# Altium schematic sheet WINGS_Components.SchDoc
size Tabloid; Revision: 1.000; SheetNumber: 2; SheetTotal: 2; Sheet_Name: Wings Components; Size: 11x17
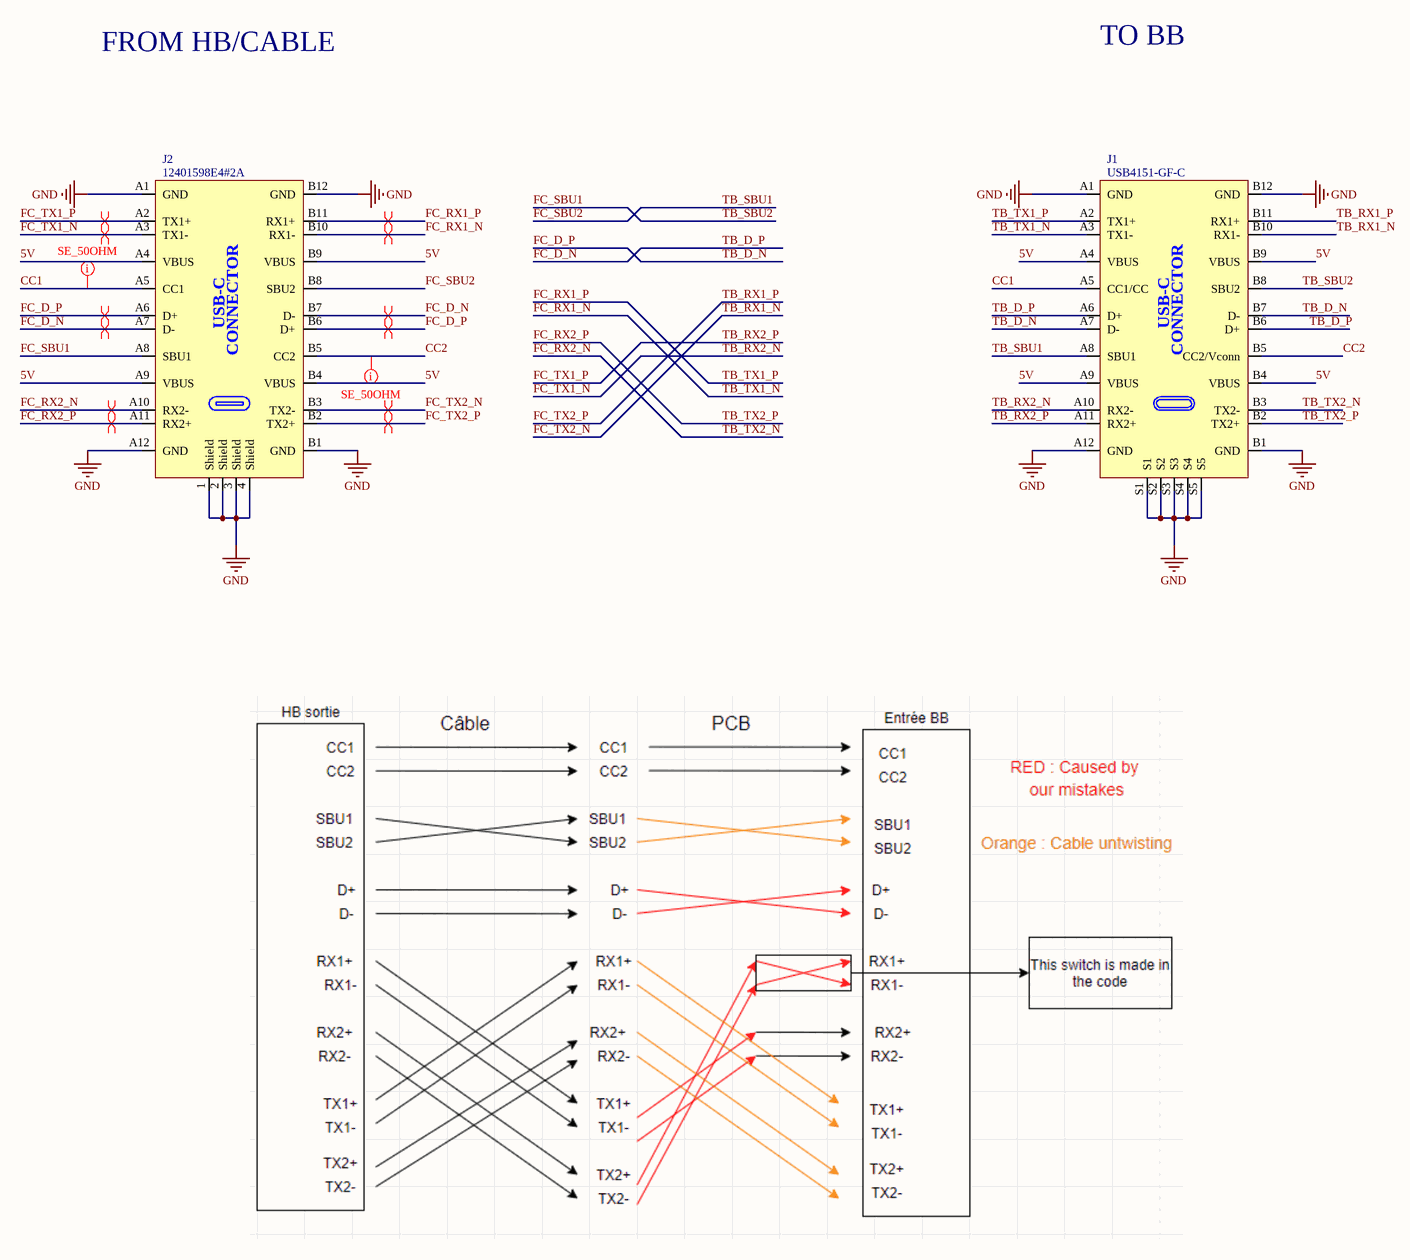
[diagram p0: WINGS_Components.SchDoc]

## Parts
J1  USB4151-GF-C  [CON_USB-C_USB4151-GF-C]
J2  12401598E4#2A  [CON_USB_3.2_TypeC_12401598E4#2A]

## Nets
GND: J1.A1(GND) J1.A12(GND) J1.B1(GND) J1.B12(GND) J1.S1 J1.S2 J1.S3 J1.S4 J1.S5 J2.1(Shield) J2.2(Shield) J2.3(Shield) J2.4(Shield) J2.A1(GND) J2.A12(GND) J2.B1(GND) J2.B12(GND)
5V: J1.A4(VBUS) J1.A9(VBUS) J1.B4(VBUS) J1.B9(VBUS) J2.A4(VBUS) J2.A9(VBUS) J2.B4(VBUS) J2.B9(VBUS)
CC1: J1.A5(CC1/CC) J2.A5(CC1)
CC2: J1.B5(CC2/Vconn) J2.B5(CC2)
FC_D_N: J1.A6(D+) J1.B6(D+) J2.A7(D-) J2.B7(D-)  [also labelled TB_D_P]
FC_D_P: J1.A7(D-) J1.B7(D-) J2.A6(D+) J2.B6(D+)  [also labelled TB_D_N]
FC_RX1_N: J1.A3(TX1-) J2.B10(RX1-)  [also labelled TB_TX1_N]
FC_RX1_P: J1.A2(TX1+) J2.B11(RX1+)  [also labelled TB_TX1_P]
FC_RX2_N: J1.B3(TX2-) J2.A10(RX2-)  [also labelled TB_TX2_N]
FC_RX2_P: J1.B2(TX2+) J2.A11(RX2+)  [also labelled TB_TX2_P]
FC_SBU1: J1.B8(SBU2) J2.A8(SBU1)  [also labelled TB_SBU2]
FC_SBU2: J1.A8(SBU1) J2.B8(SBU2)  [also labelled TB_SBU1]
FC_TX1_N: J1.A10(RX2-) J2.A3(TX1-)  [also labelled TB_RX2_N]
FC_TX1_P: J1.A11(RX2+) J2.A2(TX1+)  [also labelled TB_RX2_P]
FC_TX2_N: J1.B10(RX1-) J2.B3(TX2-)  [also labelled TB_RX1_N]
FC_TX2_P: J1.B11(RX1+) J2.B2(TX2+)  [also labelled TB_RX1_P]

## Layout directives
mark named SE_50OHM: CC1, CC2
differential pair; differential pair class DIFF_90: FC_D_N, FC_D_P, FC_TX1_N, FC_TX1_P, FC_TX2_N, FC_TX2_P
differential pair; differential pair class DIFF_90; net class TX: FC_RX1_N, FC_RX1_P, FC_RX2_N, FC_RX2_P

## Notes on the sheet
- FROM HB/CABLE
- TO BB
- Sheet Name
- Project Title
- Global Project
- Size
- Date
- Group
- Sheet
- Revision
- of
- PCB
- .
- SCH
- Filename
- Designers
- (in symbol CON_USB_3.2_TypeC_12401598E4#2A) USB-C; CONNECTOR
- (in symbol CON_USB_3.2_TypeC_USB4151-GF-C) USB-C; CONNECTOR

## Library data of the parts
J1 = CON_USB_3.2_TypeC_USB4151-GF-C: CON - USB-C (USB TYPE-C) USB 3.2 Gen 1 (USB 3.1 Gen 1, Superspeed (USB 3.0)) Plug Connector 24 Position Surface Mount, Through Hole; Manufacturer #1: GCT; Value: USB 3.2 Type C; Voltage Rating: 20VDC; Current Rating: 5A total; GRAMS Lib Spec: 2.8; Note: Vertical; Magnetic Material: Unknown; Polarized: Yes; Power Max: -; HelpURL: https://gct.co/connector/usb4151; CreatedBy/Date: Philippe Arsenault/2021-08-17; VerifiedBy: Hubert Dube/2021-09-02; Temperature: -40°C ~ 85°C; Package: SMD/TH; Assembly Type: SMD/TH; Part Number #1: USB4151-GF-C; Supplier 1: Digi-Key; Supplier Part Number 1: 2073-USB4151-GF-CCT-ND
J2 = CON_USB_3.2_TypeC_12401598E4#2A: CON_USB - USB 3.2 Gen 2 (USB 3.1 Gen 2, Superspeed + (USB 3.1)) 24 pos Receptacle - R/A; Manufacturer #1: Amphenol ICC (Commercial Products); Value: USB 3.2 Type C; Current Rating: 5A total; GRAMS Lib Spec: 2.8; Magnetic Material: Unknown; Polarized: Yes; Voltage Rating: -; Power Max: -; HelpURL: https://www.amphenol-icc.com/media/wysiwyg/files/drawing/12401598xxx2a.pdf; CreatedBy/Date: Louis-Daniel Gaulin / 07-04-2021; VerifiedBy: Philippe Arsenault/2021-04-08; Temperature: max 105°C; Package: SMD + TH R/A; Assembly Type: SMD + TH; Part Number #1: 12401598E4#2A; Supplier 1: Digi-Key; Supplier Part Number 1: 12401598E4#2ACT-ND